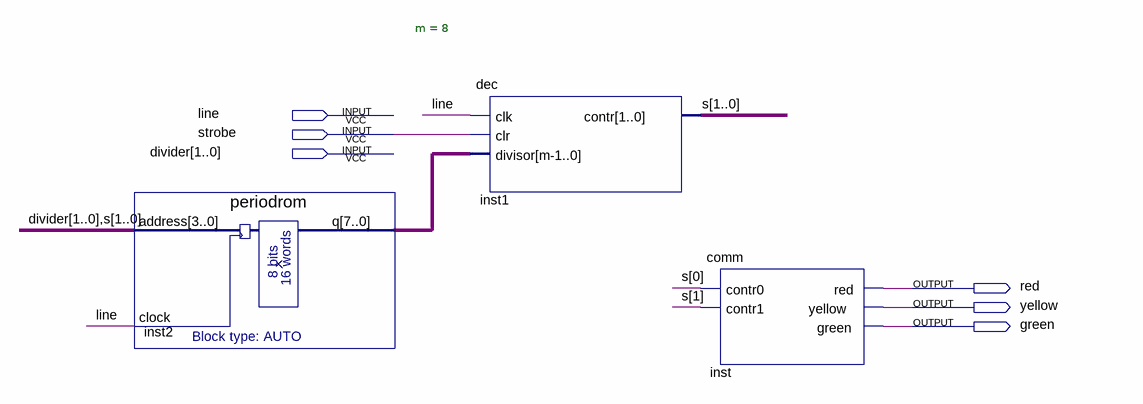
[diagram p0: schematic sheet]
// Quartus schematic semafor.bdf as structural Verilog: 3 symbols, 6 pins
module semafor (
  input  line,
  input  strobe,
  input  [1:0] divider,
  output red,
  output yellow,
  output green
);

  wire [1:0] s;
  wire [7:0] inst2_q;

  periodrom inst2 (.address({divider, s}), .clock(line), .q(inst2_q));
  dec #(.m(8)) inst1 (.clk(line), .clr(strobe), .divisor(inst2_q), .contr(s));
  comm inst (.contr0(s[0]), .contr1(s[1]), .red(red), .yellow(yellow), .green(green));
endmodule
